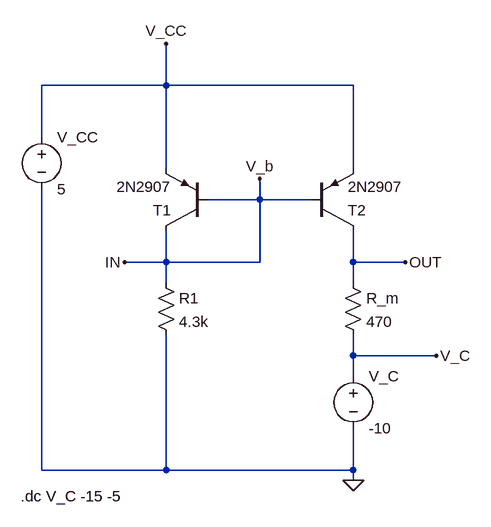
[diagram p0: schematic simple_current_mirror.asc]
simple_current_mirror.asc, the LTspice schematic file:
Version 4
SHEET 1 880 792
WIRE 128 16 128 -48
WIRE 128 16 -64 16
WIRE 416 16 128 16
WIRE -64 96 -64 16
WIRE 128 144 128 16
WIRE 416 144 416 16
WIRE 272 192 272 160
WIRE 272 192 192 192
WIRE 352 192 272 192
WIRE 128 288 128 240
WIRE 128 288 64 288
WIRE 272 288 272 192
WIRE 272 288 128 288
WIRE 416 288 416 240
WIRE 496 288 416 288
WIRE 128 320 128 288
WIRE 416 320 416 288
WIRE 416 432 416 400
WIRE 544 432 416 432
WIRE 416 464 416 432
WIRE -64 608 -64 176
WIRE 128 608 128 400
WIRE 128 608 -64 608
WIRE 416 608 416 544
WIRE 416 608 128 608
WIRE 416 624 416 608
FLAG 416 624 0
FLAG 128 -48 V_CC
FLAG 272 160 V_b
FLAG 64 288 IN
FLAG 496 288 OUT
FLAG 544 432 V_C
SYMBOL voltage -64 80 R0
WINDOW 123 0 0 Left 0
WINDOW 39 0 0 Left 0
SYMATTR InstName V_CC
SYMATTR Value 5
SYMBOL voltage 416 448 R0
WINDOW 123 0 0 Left 0
WINDOW 39 0 0 Left 0
SYMATTR InstName V_C
SYMATTR Value -10
SYMBOL pnp 192 240 R180
SYMATTR InstName T1
SYMATTR Value 2N2907
SYMBOL pnp 352 240 M180
SYMATTR InstName T2
SYMATTR Value 2N2907
SYMBOL res 112 304 R0
SYMATTR InstName R1
SYMATTR Value 4.3k
SYMBOL res 400 304 R0
SYMATTR InstName R_m
SYMATTR Value 470
TEXT -96 648 Left 2 !.dc V_C -15 -5

The netlist it stands for:
* simple_current_mirror.asc
V_CC V_CC 0 5
V_C V_C 0 -10
Q§T1 IN IN V_CC 0 2N2907
Q§T2 OUT IN V_CC 0 2N2907
R1 IN 0 4.3k
R_m OUT V_C 470
.model NPN NPN
.model PNP PNP
.lib standard.bjt
.dc V_C -15 -5
.backanno
.end